# Altium schematic sheet LED_Micro.SchDoc: LED Board Control
size B; Author: Sam Tomlinson; Organization: ORGANIZATION; Address1: ADDRESS 1; Address2: ADDRESS 2; Address3: ADDRESS 3; Address4: ADDRESS 4; Revision: -; SheetNumber: 4; SheetTotal: 6; ENG_APP_DATE: --/--/--; DSN_APP_DATE: --/--/--; CHK_APP_DATE: --/--/--; TeamLead: John Ulm; ProjectTitle: Led Board
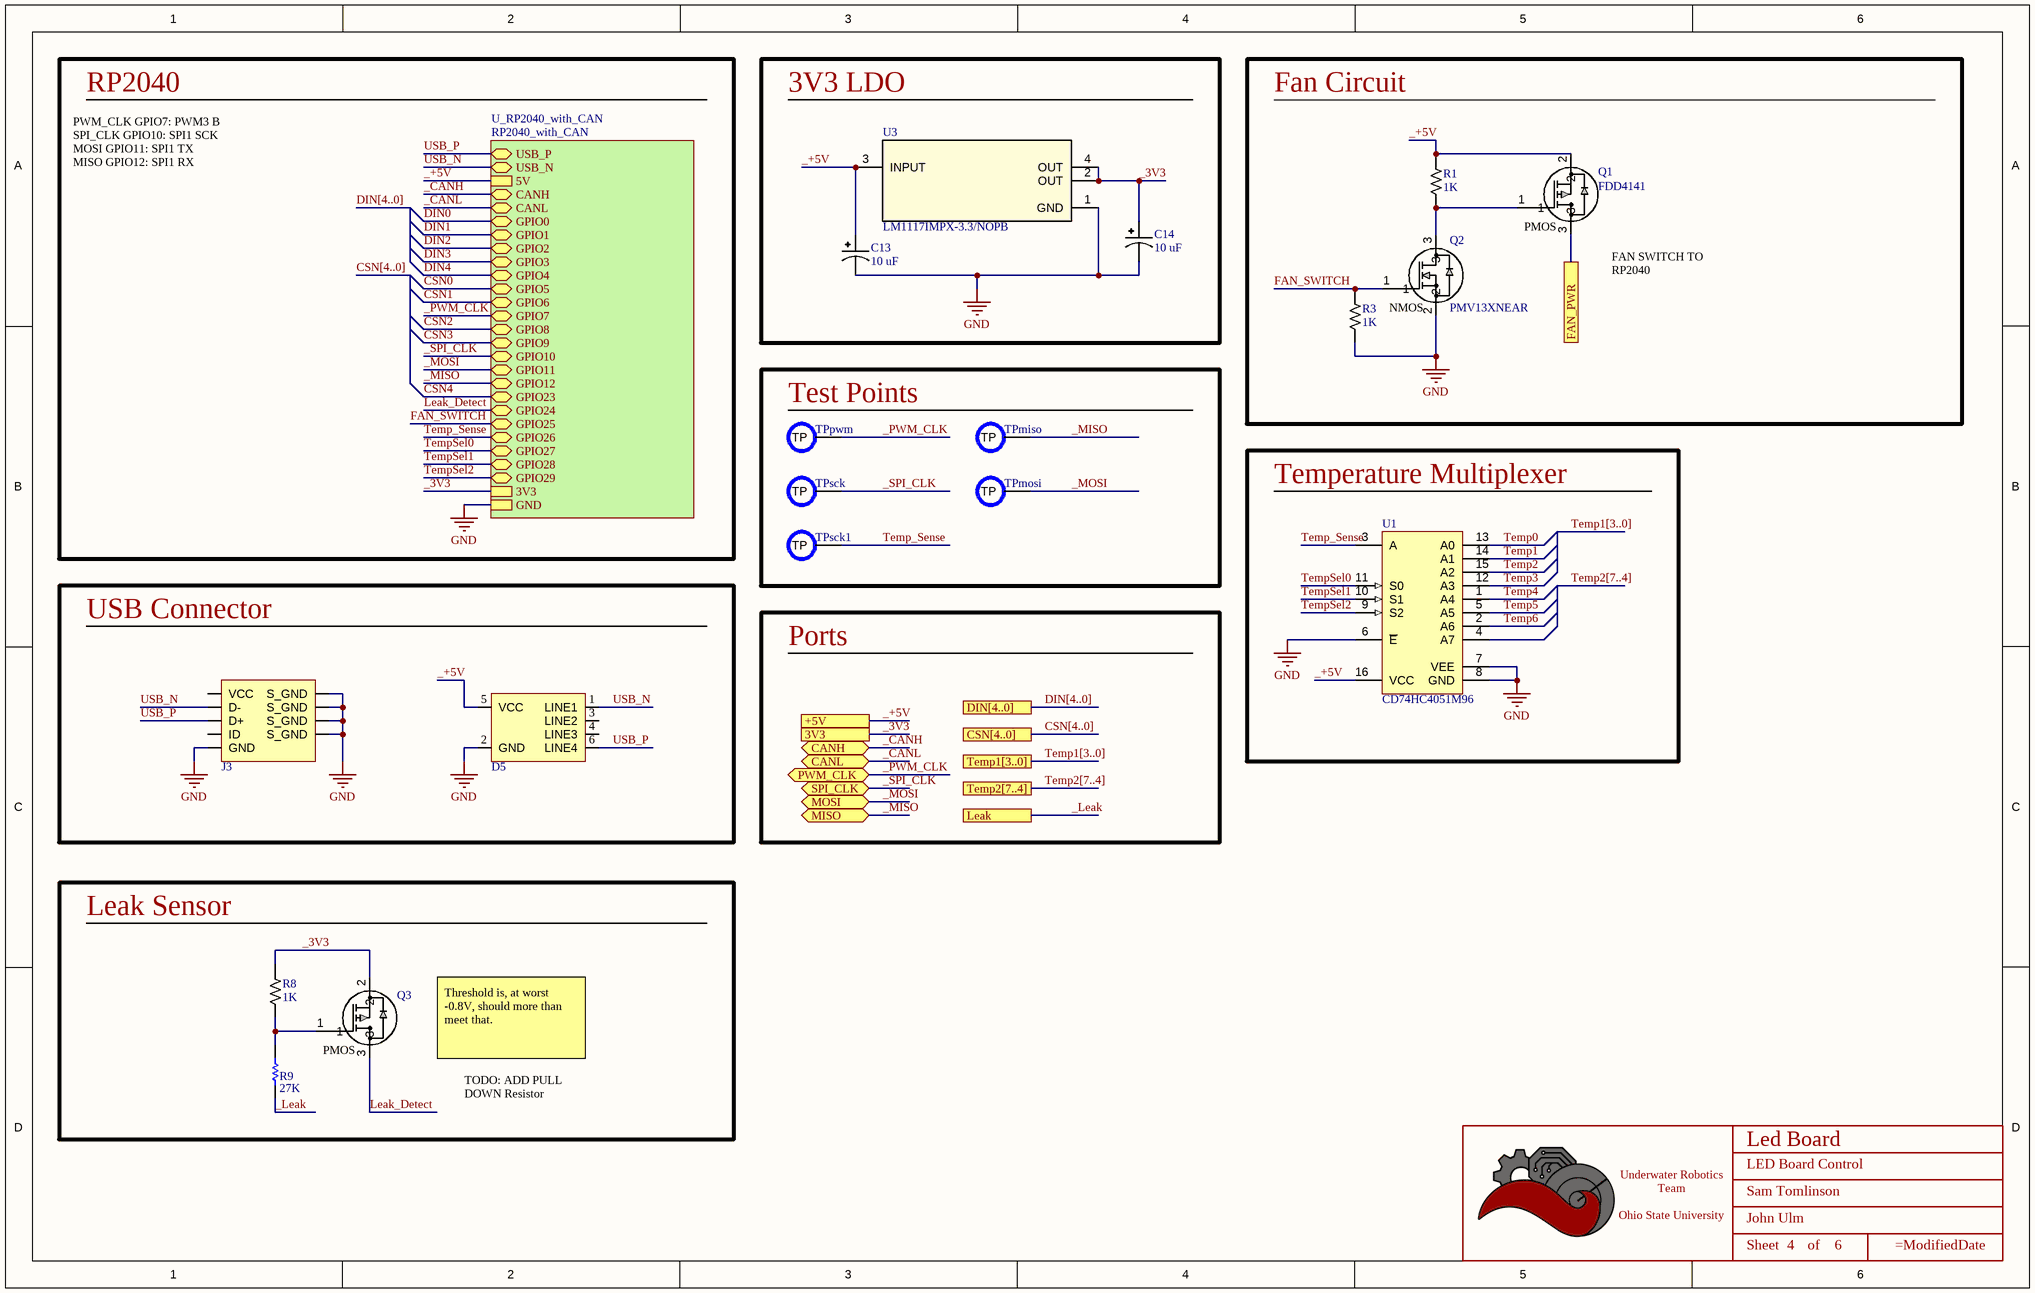
[diagram p0: LED_Micro.SchDoc]

## Parts
*  Title_Block  [LOGO]  (value not drawn)  (graphical)
C13  Value (uF): 10 uF  [CAPACITOR_1206 - POLAR]  (hidden comment: 10uF Tantalum 16V)
C14  Value (uF): 10 uF  [CAPACITOR_1206 - POLAR]  (hidden comment: 10uF Tantalum 16V)
D5  TVS DIODE 5VWM 25VC SOT23-6  [SOT 23-6L]  (value not drawn)
J3  USB_MICRO R/A  [CONN_MINIUSB]  (value not drawn)
Q1  FDD4141  [DPAK_ONS]
Q2  PMV13XNEAR  [SOT-23-3]
Q3  MOSFET P-CHANNEL 20V 4.7A SOT23  [SOT-23-3]  (value not drawn)
R1  Value  (Ohms): 1K  [RESISTOR_0603]  (hidden comment: 1k Ohm 5% 1/8W)
R3  Value  (Ohms): 1K  [RESISTOR_0603]  (hidden comment: 1k Ohm 5% 1/8W)
R8  Value  (Ohms): 1K  [RESISTOR_0402]  (hidden comment: 1k Ohm 1% 1/16W)
R9  27K  [RESC1005X40X25ML05T05]
TPmiso  PCB Test Point  [TESTPOINT_1.2MM]  (value not drawn)  (no BOM)
TPmosi  PCB Test Point  [TESTPOINT_1.2MM]  (value not drawn)  (no BOM)
TPpwm  PCB Test Point  [TESTPOINT_1.2MM]  (value not drawn)  (no BOM)
TPsck  PCB Test Point  [TESTPOINT_1.2MM]  (value not drawn)  (no BOM)
TPsck1  PCB Test Point  [TESTPOINT_1.2MM]  (value not drawn)  (no BOM)
U1  CD74HC4051M96  [D0016A_M]
U3  LM1117IMPX-3.3/NOPB  [SOT-223-4]

## Blocks framed on the sheet
3V3 LDO: C13 C14 U3
Fan Circuit: Q1 Q2 R1 R3
Test Points: TPmiso TPmosi TPpwm TPsck TPsck1
Temperature Multiplexer: U1
USB Connector: D5 J3
Leak Sensor: Q3 R8 R9

## Sub-sheets
U_RP2040_with_CAN = RP2040_with_CAN: USB_P (bidir), USB_N (bidir), 5V, CANH (bidir), CANL (bidir), GPIO0 (bidir), GPIO1 (bidir), GPIO2 (bidir), GPIO3 (bidir), GPIO4 (bidir), GPIO5 (bidir), GPIO6 (bidir), GPIO7 (bidir), GPIO8 (bidir), GPIO9 (bidir), GPIO10 (bidir), GPIO11 (bidir), GPIO12 (bidir), GPIO23 (bidir), GPIO24 (bidir), GPIO25 (bidir), GPIO26 (bidir), GPIO27 (bidir), GPIO28 (bidir), GPIO29 (bidir), 3V3, GND

## Ports
3V3, +5V, CANH (bidir), CANL (bidir), CSN[4..0], DIN[4..0], FAN_PWR, Leak, MISO (bidir), MOSI (bidir), PWM_CLK (bidir), SPI_CLK (bidir), Temp1[3..0], Temp2[7..4]

## Nets
GND: C13.2 C14.2 D5.2(GND) J3.5(GND) J3.6(S_GND) J3.7(S_GND) J3.8(S_GND) J3.9(S_GND) Q2.2 R3.2 U1.6(~{E}) U1.7(VEE) U1.8(GND) U3.1(GND) ; sheet U_RP2040_with_CAN/GND
_3V3: C14.1 Q3.2 R8.1 U3.2(OUT) U3.4(OUT) ; port 3V3, sheet U_RP2040_with_CAN/3V3
_+5V: C13.1 D5.5(VCC) Q1.2 R1.1 U1.16(VCC) U3.3(INPUT) ; port +5V, sheet U_RP2040_with_CAN/5V
_CANH: port CANH, sheet U_RP2040_with_CAN/CANH
_CANL: port CANL, sheet U_RP2040_with_CAN/CANL
_Leak: R9.1 ; port Leak
_MISO: TPmiso.TP ; port MISO, sheet U_RP2040_with_CAN/GPIO12
_MOSI: TPmosi.TP ; port MOSI, sheet U_RP2040_with_CAN/GPIO11
_PWM_CLK: TPpwm.TP ; port PWM_CLK, sheet U_RP2040_with_CAN/GPIO7
_SPI_CLK: TPsck.TP ; port SPI_CLK, sheet U_RP2040_with_CAN/GPIO10
CSN0: sheet U_RP2040_with_CAN/GPIO5
CSN1: sheet U_RP2040_with_CAN/GPIO6
CSN2: sheet U_RP2040_with_CAN/GPIO8
CSN3: sheet U_RP2040_with_CAN/GPIO9
CSN4: sheet U_RP2040_with_CAN/GPIO23
DIN0: sheet U_RP2040_with_CAN/GPIO0
DIN1: sheet U_RP2040_with_CAN/GPIO1
DIN2: sheet U_RP2040_with_CAN/GPIO2
DIN3: sheet U_RP2040_with_CAN/GPIO3
DIN4: sheet U_RP2040_with_CAN/GPIO4
FAN_PWR: Q1.3 ; port FAN_PWR
FAN_SWITCH: Q2.1 R3.1 ; sheet U_RP2040_with_CAN/GPIO25
Leak_Detect: Q3.3 ; sheet U_RP2040_with_CAN/GPIO24
Temp0: U1.13(A0)
Temp1: U1.14(A1)
Temp2: U1.15(A2)
Temp3: U1.12(A3)
Temp4: U1.1(A4)
Temp5: U1.5(A5)
Temp6: U1.2(A6)
Temp_Sense: TPsck1.TP U1.3(A) ; sheet U_RP2040_with_CAN/GPIO26
TempSel0: U1.11(S0) ; sheet U_RP2040_with_CAN/GPIO27
TempSel1: U1.10(S1) ; sheet U_RP2040_with_CAN/GPIO28
TempSel2: U1.9(S2) ; sheet U_RP2040_with_CAN/GPIO29
USB_N: D5.1(LINE1) J3.2(D-) ; sheet U_RP2040_with_CAN/USB_N
USB_P: D5.6(LINE4) J3.3(D+) ; sheet U_RP2040_with_CAN/USB_P
NetQ1_1: Q1.1 Q2.3 R1.2
NetQ3_1: Q3.1 R8.2 R9.2

Not connected (* = marked no-connect by the designer): D5 3(LINE2) 4(LINE3); J3 1(VCC) 4(ID); U1 4(A7)

## Buses and harness runs
bus CSN[4..0]
bus CSN[4..0] = port CSN[4..0]
bus DIN[4..0]
bus DIN[4..0] = port DIN[4..0]
bus Temp1[3..0]
bus Temp1[3..0] = port Temp1[3..0]
bus Temp2[7..4]
bus Temp2[7..4] = port Temp2[7..4]

## Notes on the sheet
- RP2040
- PWM_CLK GPIO7: PWM3 B
  SPI_CLK GPIO10: SPI1 SCK
  MOSI GPIO11: SPI1 TX
  MISO GPIO12: SPI1 RX
- (near Q1) FAN SWITCH TO RP2040
- Ports
- Threshold is, at worst -0.8V, should more than meet that.
- TODO: ADD PULL DOWN Resistor
- DWG. NO.
- REV.
- SHT.
- THIS DOCUMENT AND THE DATA DISCLOSED HEREIN OR HEREWITH IS THE PROPERTY OF ALTIUM LIMITED AND MAY BE FREELY DISTRIBUTED IN WHOLE. NO RIGHTS ARE RESERVED OR EXPRESS OR IMPLIED WARANTEE GIVEN.
- REVISION
- DESCRIPTION
- DATE
- APPROVED
- ENG:
- APPROVALS
- PROJECT
- DSN:
- CHK:
- REFERENCE DOCUMENTS
- PROJECT REVISION:
- TITLE
- DOCUMENT REVISION:
- DESIGN ITEM:
- BOM:
- FAB DWG:
- PCB DWG:
- ASSY DWG:
- SCALE:
- SIZE
- B
- CAGE CODE
- FILE NAME
- DWG NO.
- SHEET
- OF
- REV
- (in symbol FDD4141) PMOS
- (in symbol PMV13XNEAR) NMOS
- (in symbol Title_Block) Underwater Robotics Team / Ohio State University; Sheet; of
- (in symbol TSM500P02CX) PMOS

## Library data of the parts
* = Title_Block: UWRT Schematic Title Block Template / Created June 2021, Dylan Trainor
C13 C14 = CAPACITOR_10uF_1206_Tantalum_1: Cap 10uF 16V +/-20% / Tantalum 1206; Tolerance: +/- 10%; Made By: Dylan T; ComponentLink1Description: Digikey; ComponentLink1URL: https://www.digikey.com/en/products/detail/kyocera-avx/F981A106MMA/4004990; Voltage: 16V; Supplier 1: Newark; Supplier Part Number 1: 26AC4143
D5 = RCLAMP0504S.TCT: 25V Clamp 6A (8/20µs) Ipp Tvs Diode Surface Mount SOT-23-6; Made By: Robert Pafford; Reverse Standoff Voltage (Typ): 5V; Breakdown Voltage (Min): 6V; Supplier 1: Digi-Key; Supplier Part Number 1: RCLAMP0504SCT-ND; Clamping Voltage (Max): 25V
J3 = CONN_MICROUSB: Amphenol Micro USB-B / USB2.0 5 Pin Right Angle SMD; Pitch: 0.65mm; Current Per Pin: 1.8A; Number of Positions: 5; Manufacturer: Amphenol; Configuration: Right Angle; Color: Silver; Created By: Flip B; ComponentLink1Description: Datasheet; ComponentLink1URL: https://cdn.amphenol-icc.com/media/wysiwyg/files/documentation/datasheet/inputoutput/io_usb_micro.pdf?__cf_chl_jschl_tk__=05693735e19256298f6ef6ca2bb2e65c376a4f56-1625503833-0-Abitsb0-ufjOXJYs_S3J3r2iTn-nObalbmXUksF1VvO_h_WEmRdMlUD1I8-hmWSEVWzY1pirKnrPZWfgY3851qyBZe5ZvnNQePLGIzUgdEIQBVUyW36RsbYpDLEWxJ4horD-5gChFgobLYqwmG5aHl0E8lIn_twwPPrOxilK2gP0q9t_CNOs_u5fMqXvXUrlsOv8tIE2NRlu6NVP8qtkL2GjhlkeTUbDMF8WvvpPDTFOgvZ4Y16Ej8F8AhWos88mo5B1HssXozw0XrkJQIqERITUu6rqloz9kf4ZzhBHtDAt-IkiAFY_Ds9SW8FYKKTtINJVpHZQ6Gyu1FFM4Dc9MO0maE8_mmNcwlxqyRoRk_MPWW8VyByXWM5RSp52jteRKw7FeI9WIYvCbPAOy0Eyib-aseIQsnGbglBcUY6_2xp8GYaJM38H3dNvBPsSOfJBPndKedwKHllxjkucXn6xsN0sDXkpGN-cu8_2bDTJ0g-uUucKSCooYX-ApSDNGpkA_p9zv1SOAD8c0zaZVmtiBsN75QpVz2rzq9_BFxOywPvR; Series: 10118192; Supplier 1: Digi-Key; Supplier Part Number 1: 609-4613-1-ND
Q1 = FDD4141: P-Channel 10.8A (Ta), 50A (Tc) 2.4W (Ta), 69W (Tc) Surface Mount D-PAK (TO-252AA); FET Type: P-Channel, Power; Vendor: ON Semiconductor; SourceLibrary: ON_Semiconductor_2020-01-13; Vgs (Max): ±20V; Vgs (th): 3V @ 250µA; Vdss: 40 V; Rds (on): 12.3mOhm @ 12.7A, 10V; Amp Rating: 10.8 A; Package: D-PAK (TO-252AA); Manufacturer_Part_Number: FDD4141; Power Dissipation: 2.4W (Ta), 69W (Tc); Supplier 1: Digi-Key; Supplier Part Number 1: FDD4141CT-ND; Created By: Dylan T
Q2 = PMV13XNEAR: N-Channel 20 V 7.3A (Ta) 610mW (Ta), 8.3W (Tc) Surface Mount TO-236AB; Vendor: Nexperia USA Inc.; SourceLibrary: ON_Semiconductor_2020-01-13; Vgs (Max): +/- 12 V; Vgs (th): 1.3V @ 250uA; Vdss: 20 V; Rds (on): 15mOhm @ 7.3A, 8V; Amp Rating: 7.3 A; FET Type: N-Channel; Package: SOT23-3L; Manufacturer _Part_Number: PMV13XNEAR; Power Dissipation: 610mW (Ta), 8.3W (Tc); Created By: Dylan T; Supplier 1: Mouser; Supplier Part Number 1: 771-PMV13XNEAR
Q3 = TSM500P02CX: P-Channel 20 V 4.7A (Tc) 1.56W (Tc) Surface Mount SOT-23; Vendor: Taiwan Semiconductor Corporation; Vgs (Max): ±10V; Vgs (th): 800mV @ 250µA; Rds (on): 50mOhm @ 3A, 4.5V; Amp Rating: 4.7 A; FET Type: P-Channel; Package: TO-236-3, SC-59, SOT-23-3; Manufacturer_Part_Number: TSM500P02CX; Vdss: 20 V; Power Dissipation: 1.56W (Tc); Created By: Robert Pafford; Supplier 1: Digi-Key; Supplier Part Number 1: TSM500P02CXRFGCT-ND
R1 R3 = RESISTOR_1K_0603: RES 1k OHM 5% 1/8W 0603; Tolerance: +/- 5%; Made By: Robert Pafford; ComponentLink1Description: Datasheet; ComponentLink1URL: https://www.bourns.com/docs/product-datasheets/CRxxxxx.pdf; Wattage: 1/8W; Supplier: Digikey; Digikey Part Numer: CR0603-JW-104ELFTR-ND; Supplier 1: Digi-Key; Supplier Part Number 1: 2019-RK73B1JTTD102JCT-ND
R8 = RESISTOR_1K_0402: RES 1k OHM 1% 1/16W 0402; Tolerance: +/- 1%; Made By: Robert Pafford; Wattage: 1/16W; Supplier: Digikey; Digikey Part Numer: CR0603-JW-104ELFTR-ND; Supplier 1: Digi-Key; Supplier Part Number 1: 13-AC0402FR-131KLCT-ND
R9 = CMP-2002-00501-1: RES SMD 27K OHM 5% 1/10W 0402ERJ-2GEJ273X; Manufacturer: Panasonic; Part Number: ERJ-2GEJ273X
TPmiso TPmosi TPpwm TPsck TPsck1 = TESTPOINT: Made By: Robert Pafford
U1 = CMP-1575-00036-4: High Speed CMOS 8-Channel Analog Multiplexer/Demultiplexer, D0016A, LARGE T&R; Manufacturer: Texas Instruments; Crosstalk: Yes; Ron(Max)(Ohms): 130; VCC(Min)(V): 2; Bandwidth(Max)(MHz): 180; VCC(Max)(V): 6; Rating: Catalog; Configuration: 1 X 1：8 MUX; Ron(Typ)(Ohms): 45; Generic Part Number: CD74HC4051; Output Type: CMOS; Operating Temperature Range(C): -55 to 125; DatasheetVersion: SCHS122J; Code_JEDEC: MS-012 variation AC; PackageReference: D0016A; PackageVersion: http://www.ti.com/lit/ml/mpds178g/mpds178g.pdf
U3 = LM1117IMPX-3.3/NOPB: IC REG LIN 3.3V 800MA SOT223-4; PartNumber: LM1117IMP-3.3/NOPB; Manufacturer: Texas Instruments; Vin (Max): 15V; Supplier 1: Digi-Key; Supplier Part Number 1: LM1117IMPX-3.3/NOPBCT-ND; Vout (Min/Fixed): 3.3V; Amp Out: 800mA; Package: SOT-223-4; Created By: Dylan T